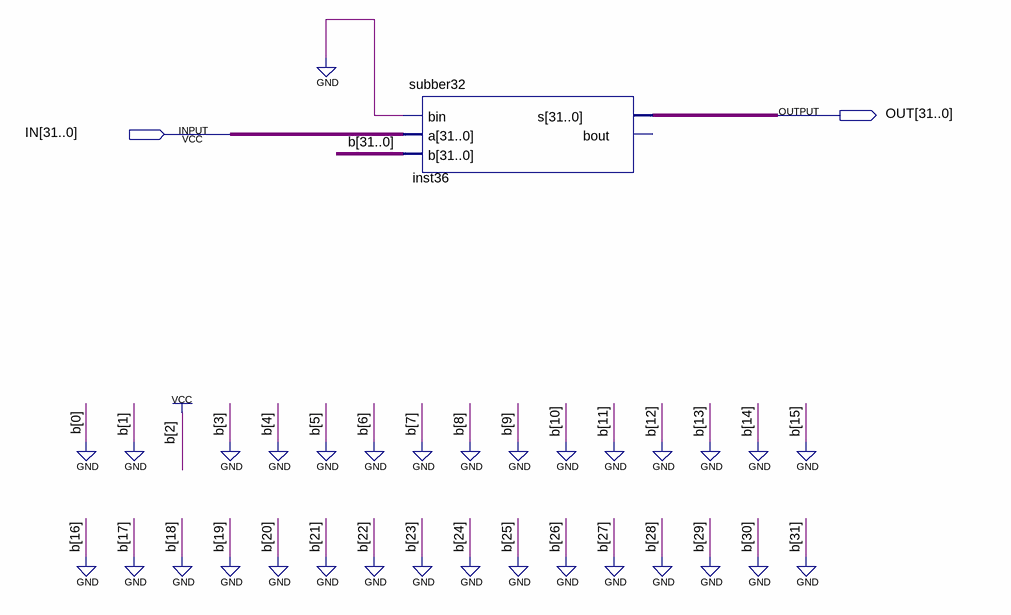
[diagram p0: schematic sheet]
// Quartus schematic fourDecrementer32.bdf as structural Verilog: 1 symbols, 2 pins
module fourDecrementer32 (
  input  [31:0] IN,
  output [31:0] OUT
);

  subber32 inst36 (.bin(1'b0), .a(IN), .b(32'b00000000000000000000000000000100), .s(OUT));  // open: bout
endmodule
